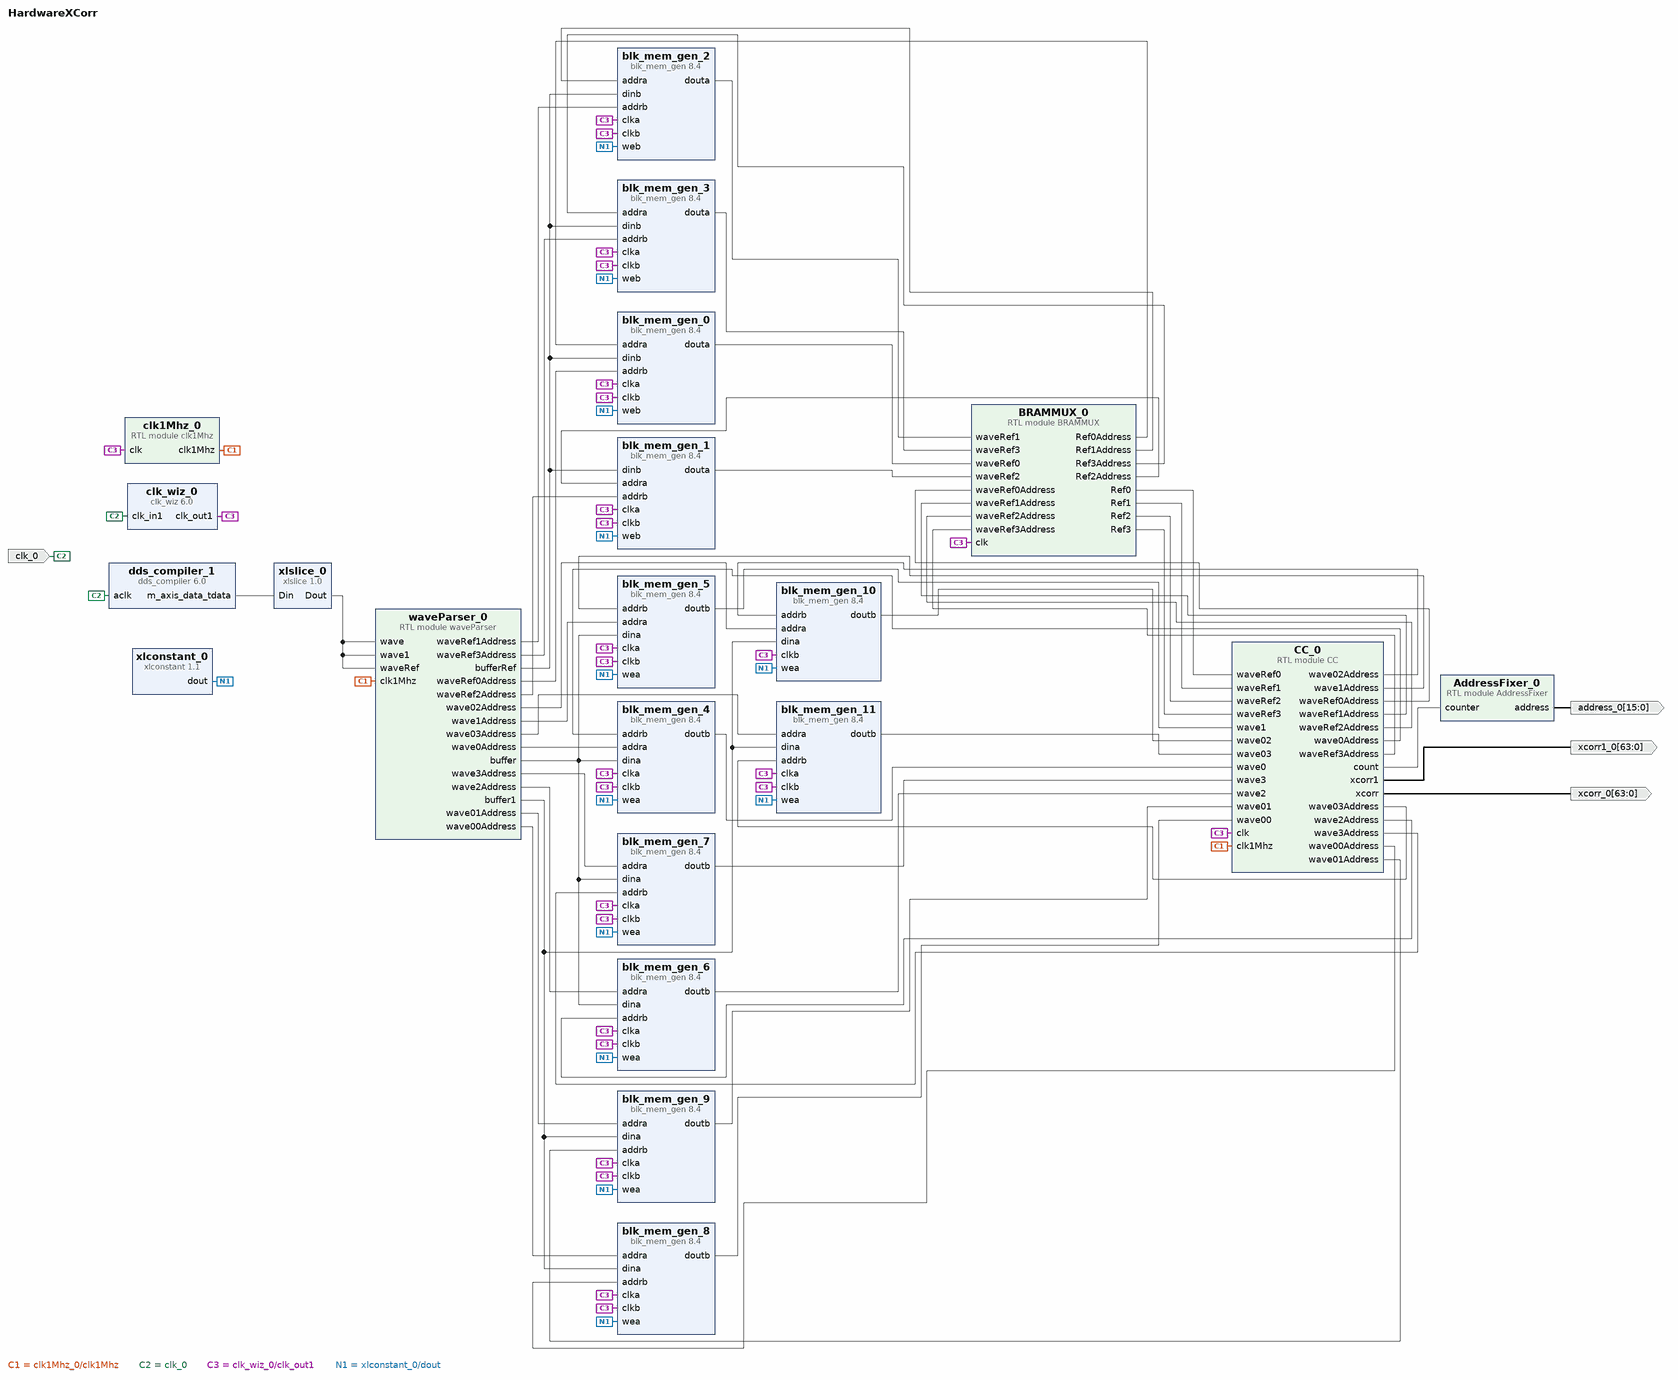
[diagram p0: block diagram of the top level]
# Vivado block design HardwareXCorr, xc7s25csga225-1, Vivado 2023.2
create_bd_design HardwareXCorr

create_bd_port -dir I -type clk clk_0
create_bd_port -dir O -from 63 -to 0 xcorr_0
create_bd_port -dir O -from 15 -to 0 address_0
create_bd_port -dir O -from 63 -to 0 xcorr1_0

create_bd_cell -type ip -vlnv xilinx.com:ip:clk_wiz:6.0 clk_wiz_0
set_property -dict [list \
  CONFIG.CLKOUT1_JITTER 114.829 \
  CONFIG.CLKOUT1_REQUESTED_OUT_FREQ 200.000 \
  CONFIG.MMCM_CLKOUT0_DIVIDE_F 5.000 \
  CONFIG.USE_LOCKED false \
  CONFIG.USE_RESET false \
] [get_bd_cells clk_wiz_0]
create_bd_cell -type ip -vlnv xilinx.com:ip:dds_compiler:6.0 dds_compiler_1
set_property -dict [list \
  CONFIG.DATA_Has_TLAST Not_Required \
  CONFIG.Has_Phase_Out true \
  CONFIG.Latency 7 \
  CONFIG.M_DATA_Has_TUSER Not_Required \
  CONFIG.Noise_Shaping None \
  CONFIG.Output_Frequency1 0 \
  CONFIG.Output_Selection Sine \
  CONFIG.Output_Width 12 \
  CONFIG.PINC1 1 \
  CONFIG.Parameter_Entry Hardware_Parameters \
  CONFIG.PartsPresent Phase_Generator_and_SIN_COS_LUT \
  CONFIG.Phase_Width 12 \
  CONFIG.S_PHASE_Has_TUSER Not_Required \
] [get_bd_cells dds_compiler_1]
create_bd_cell -type ip -vlnv xilinx.com:ip:xlslice:1.0 xlslice_0
set_property -dict {CONFIG.DIN_FROM 11 CONFIG.DIN_WIDTH 16 CONFIG.DOUT_WIDTH 12} [get_bd_cells xlslice_0]
create_bd_cell -type ip -vlnv xilinx.com:ip:blk_mem_gen:8.4 blk_mem_gen_0
set_property -dict [list \
  CONFIG.Enable_32bit_Address false \
  CONFIG.Enable_A Always_Enabled \
  CONFIG.Enable_B Always_Enabled \
  CONFIG.Memory_Type True_Dual_Port_RAM \
  CONFIG.Port_B_Clock 100 \
  CONFIG.Port_B_Enable_Rate 100 \
  CONFIG.Port_B_Write_Rate 50 \
  CONFIG.Read_Width_A 12 \
  CONFIG.Read_Width_B 12 \
  CONFIG.Register_PortA_Output_of_Memory_Primitives true \
  CONFIG.Register_PortB_Output_of_Memory_Primitives true \
  CONFIG.Use_Byte_Write_Enable false \
  CONFIG.Use_RSTA_Pin false \
  CONFIG.Write_Depth_A 2501 \
  CONFIG.Write_Width_A 12 \
  CONFIG.Write_Width_B 12 \
  CONFIG.use_bram_block Stand_Alone \
] [get_bd_cells blk_mem_gen_0]
create_bd_cell -type ip -vlnv xilinx.com:ip:blk_mem_gen:8.4 blk_mem_gen_1
set_property -dict [list \
  CONFIG.Enable_32bit_Address false \
  CONFIG.Enable_A Always_Enabled \
  CONFIG.Enable_B Always_Enabled \
  CONFIG.Memory_Type True_Dual_Port_RAM \
  CONFIG.Port_B_Clock 100 \
  CONFIG.Port_B_Enable_Rate 100 \
  CONFIG.Port_B_Write_Rate 50 \
  CONFIG.Read_Width_A 12 \
  CONFIG.Read_Width_B 12 \
  CONFIG.Register_PortA_Output_of_Memory_Primitives true \
  CONFIG.Register_PortB_Output_of_Memory_Primitives true \
  CONFIG.Use_Byte_Write_Enable false \
  CONFIG.Use_RSTA_Pin false \
  CONFIG.Write_Depth_A 2501 \
  CONFIG.Write_Width_A 12 \
  CONFIG.Write_Width_B 12 \
  CONFIG.use_bram_block Stand_Alone \
] [get_bd_cells blk_mem_gen_1]
create_bd_cell -type ip -vlnv xilinx.com:ip:blk_mem_gen:8.4 blk_mem_gen_2
set_property -dict [list \
  CONFIG.Enable_32bit_Address false \
  CONFIG.Enable_A Always_Enabled \
  CONFIG.Enable_B Always_Enabled \
  CONFIG.Memory_Type True_Dual_Port_RAM \
  CONFIG.Port_B_Clock 100 \
  CONFIG.Port_B_Enable_Rate 100 \
  CONFIG.Port_B_Write_Rate 50 \
  CONFIG.Read_Width_A 12 \
  CONFIG.Read_Width_B 12 \
  CONFIG.Register_PortA_Output_of_Memory_Primitives true \
  CONFIG.Register_PortB_Output_of_Memory_Primitives true \
  CONFIG.Use_Byte_Write_Enable false \
  CONFIG.Use_RSTA_Pin false \
  CONFIG.Write_Depth_A 2501 \
  CONFIG.Write_Width_A 12 \
  CONFIG.Write_Width_B 12 \
  CONFIG.use_bram_block Stand_Alone \
] [get_bd_cells blk_mem_gen_2]
create_bd_cell -type ip -vlnv xilinx.com:ip:blk_mem_gen:8.4 blk_mem_gen_3
set_property -dict [list \
  CONFIG.Enable_32bit_Address false \
  CONFIG.Enable_A Always_Enabled \
  CONFIG.Enable_B Always_Enabled \
  CONFIG.Memory_Type True_Dual_Port_RAM \
  CONFIG.Port_B_Clock 100 \
  CONFIG.Port_B_Enable_Rate 100 \
  CONFIG.Port_B_Write_Rate 50 \
  CONFIG.Read_Width_A 12 \
  CONFIG.Read_Width_B 12 \
  CONFIG.Register_PortA_Output_of_Memory_Primitives true \
  CONFIG.Register_PortB_Output_of_Memory_Primitives true \
  CONFIG.Use_Byte_Write_Enable false \
  CONFIG.Use_RSTA_Pin false \
  CONFIG.Write_Depth_A 2501 \
  CONFIG.Write_Width_A 12 \
  CONFIG.Write_Width_B 12 \
  CONFIG.use_bram_block Stand_Alone \
] [get_bd_cells blk_mem_gen_3]
create_bd_cell -type ip -vlnv xilinx.com:ip:xlconstant:1.1 xlconstant_0
create_bd_cell -type ip -vlnv xilinx.com:ip:blk_mem_gen:8.4 blk_mem_gen_4
set_property -dict [list \
  CONFIG.Enable_32bit_Address false \
  CONFIG.Enable_A Always_Enabled \
  CONFIG.Enable_B Always_Enabled \
  CONFIG.Memory_Type True_Dual_Port_RAM \
  CONFIG.Port_B_Clock 100 \
  CONFIG.Port_B_Enable_Rate 100 \
  CONFIG.Port_B_Write_Rate 50 \
  CONFIG.Read_Width_A 12 \
  CONFIG.Read_Width_B 12 \
  CONFIG.Register_PortA_Output_of_Memory_Primitives true \
  CONFIG.Register_PortB_Output_of_Memory_Primitives true \
  CONFIG.Use_Byte_Write_Enable false \
  CONFIG.Use_RSTA_Pin false \
  CONFIG.Write_Depth_A 2501 \
  CONFIG.Write_Width_A 12 \
  CONFIG.Write_Width_B 12 \
  CONFIG.use_bram_block Stand_Alone \
] [get_bd_cells blk_mem_gen_4]
create_bd_cell -type ip -vlnv xilinx.com:ip:blk_mem_gen:8.4 blk_mem_gen_5
set_property -dict [list \
  CONFIG.Enable_32bit_Address false \
  CONFIG.Enable_A Always_Enabled \
  CONFIG.Enable_B Always_Enabled \
  CONFIG.Memory_Type True_Dual_Port_RAM \
  CONFIG.Port_B_Clock 100 \
  CONFIG.Port_B_Enable_Rate 100 \
  CONFIG.Port_B_Write_Rate 50 \
  CONFIG.Read_Width_A 12 \
  CONFIG.Read_Width_B 12 \
  CONFIG.Register_PortA_Output_of_Memory_Primitives true \
  CONFIG.Register_PortB_Output_of_Memory_Primitives true \
  CONFIG.Use_Byte_Write_Enable false \
  CONFIG.Use_RSTA_Pin false \
  CONFIG.Write_Depth_A 2501 \
  CONFIG.Write_Width_A 12 \
  CONFIG.Write_Width_B 12 \
  CONFIG.use_bram_block Stand_Alone \
] [get_bd_cells blk_mem_gen_5]
create_bd_cell -type ip -vlnv xilinx.com:ip:blk_mem_gen:8.4 blk_mem_gen_6
set_property -dict [list \
  CONFIG.Enable_32bit_Address false \
  CONFIG.Enable_A Always_Enabled \
  CONFIG.Enable_B Always_Enabled \
  CONFIG.Memory_Type True_Dual_Port_RAM \
  CONFIG.Port_B_Clock 100 \
  CONFIG.Port_B_Enable_Rate 100 \
  CONFIG.Port_B_Write_Rate 50 \
  CONFIG.Read_Width_A 12 \
  CONFIG.Read_Width_B 12 \
  CONFIG.Register_PortA_Output_of_Memory_Primitives true \
  CONFIG.Register_PortB_Output_of_Memory_Primitives true \
  CONFIG.Use_Byte_Write_Enable false \
  CONFIG.Use_RSTA_Pin false \
  CONFIG.Write_Depth_A 2501 \
  CONFIG.Write_Width_A 12 \
  CONFIG.Write_Width_B 12 \
  CONFIG.use_bram_block Stand_Alone \
] [get_bd_cells blk_mem_gen_6]
create_bd_cell -type ip -vlnv xilinx.com:ip:blk_mem_gen:8.4 blk_mem_gen_7
set_property -dict [list \
  CONFIG.Enable_32bit_Address false \
  CONFIG.Enable_A Always_Enabled \
  CONFIG.Enable_B Always_Enabled \
  CONFIG.Memory_Type True_Dual_Port_RAM \
  CONFIG.Port_B_Clock 100 \
  CONFIG.Port_B_Enable_Rate 100 \
  CONFIG.Port_B_Write_Rate 50 \
  CONFIG.Read_Width_A 12 \
  CONFIG.Read_Width_B 12 \
  CONFIG.Register_PortA_Output_of_Memory_Primitives true \
  CONFIG.Register_PortB_Output_of_Memory_Primitives true \
  CONFIG.Use_Byte_Write_Enable false \
  CONFIG.Use_RSTA_Pin false \
  CONFIG.Write_Depth_A 2501 \
  CONFIG.Write_Width_A 12 \
  CONFIG.Write_Width_B 12 \
  CONFIG.use_bram_block Stand_Alone \
] [get_bd_cells blk_mem_gen_7]
create_bd_cell -type ip -vlnv xilinx.com:ip:blk_mem_gen:8.4 blk_mem_gen_8
set_property -dict [list \
  CONFIG.Assume_Synchronous_Clk true \
  CONFIG.Enable_32bit_Address false \
  CONFIG.Enable_A Always_Enabled \
  CONFIG.Enable_B Always_Enabled \
  CONFIG.Memory_Type True_Dual_Port_RAM \
  CONFIG.Port_B_Clock 100 \
  CONFIG.Port_B_Enable_Rate 100 \
  CONFIG.Port_B_Write_Rate 50 \
  CONFIG.Read_Width_A 12 \
  CONFIG.Read_Width_B 12 \
  CONFIG.Register_PortA_Output_of_Memory_Primitives true \
  CONFIG.Register_PortB_Output_of_Memory_Primitives true \
  CONFIG.Use_Byte_Write_Enable false \
  CONFIG.Use_RSTA_Pin false \
  CONFIG.Write_Depth_A 2501 \
  CONFIG.Write_Width_A 12 \
  CONFIG.Write_Width_B 12 \
  CONFIG.use_bram_block Stand_Alone \
] [get_bd_cells blk_mem_gen_8]
create_bd_cell -type ip -vlnv xilinx.com:ip:blk_mem_gen:8.4 blk_mem_gen_9
set_property -dict [list \
  CONFIG.Assume_Synchronous_Clk true \
  CONFIG.Enable_32bit_Address false \
  CONFIG.Enable_A Always_Enabled \
  CONFIG.Enable_B Always_Enabled \
  CONFIG.Memory_Type True_Dual_Port_RAM \
  CONFIG.Port_B_Clock 100 \
  CONFIG.Port_B_Enable_Rate 100 \
  CONFIG.Port_B_Write_Rate 50 \
  CONFIG.Read_Width_A 12 \
  CONFIG.Read_Width_B 12 \
  CONFIG.Register_PortA_Output_of_Memory_Primitives true \
  CONFIG.Register_PortB_Output_of_Memory_Primitives true \
  CONFIG.Use_Byte_Write_Enable false \
  CONFIG.Use_RSTA_Pin false \
  CONFIG.Write_Depth_A 2501 \
  CONFIG.Write_Width_A 12 \
  CONFIG.Write_Width_B 12 \
  CONFIG.use_bram_block Stand_Alone \
] [get_bd_cells blk_mem_gen_9]
create_bd_cell -type ip -vlnv xilinx.com:ip:blk_mem_gen:8.4 blk_mem_gen_10
set_property -dict [list \
  CONFIG.Assume_Synchronous_Clk true \
  CONFIG.Enable_32bit_Address false \
  CONFIG.Enable_A Always_Enabled \
  CONFIG.Enable_B Always_Enabled \
  CONFIG.Memory_Type True_Dual_Port_RAM \
  CONFIG.Port_B_Clock 100 \
  CONFIG.Port_B_Enable_Rate 100 \
  CONFIG.Port_B_Write_Rate 50 \
  CONFIG.Read_Width_A 12 \
  CONFIG.Read_Width_B 12 \
  CONFIG.Register_PortA_Output_of_Memory_Primitives true \
  CONFIG.Register_PortB_Output_of_Memory_Primitives true \
  CONFIG.Use_Byte_Write_Enable false \
  CONFIG.Use_RSTA_Pin false \
  CONFIG.Write_Depth_A 2501 \
  CONFIG.Write_Width_A 12 \
  CONFIG.Write_Width_B 12 \
  CONFIG.use_bram_block Stand_Alone \
] [get_bd_cells blk_mem_gen_10]
create_bd_cell -type ip -vlnv xilinx.com:ip:blk_mem_gen:8.4 blk_mem_gen_11
set_property -dict [list \
  CONFIG.Assume_Synchronous_Clk true \
  CONFIG.Enable_32bit_Address false \
  CONFIG.Enable_A Always_Enabled \
  CONFIG.Enable_B Always_Enabled \
  CONFIG.Memory_Type True_Dual_Port_RAM \
  CONFIG.Port_B_Clock 100 \
  CONFIG.Port_B_Enable_Rate 100 \
  CONFIG.Port_B_Write_Rate 50 \
  CONFIG.Read_Width_A 12 \
  CONFIG.Read_Width_B 12 \
  CONFIG.Register_PortA_Output_of_Memory_Primitives true \
  CONFIG.Register_PortB_Output_of_Memory_Primitives true \
  CONFIG.Use_Byte_Write_Enable false \
  CONFIG.Use_RSTA_Pin false \
  CONFIG.Write_Depth_A 2501 \
  CONFIG.Write_Width_A 12 \
  CONFIG.Write_Width_B 12 \
  CONFIG.use_bram_block Stand_Alone \
] [get_bd_cells blk_mem_gen_11]
create_bd_cell -type module -reference BRAMMUX BRAMMUX_0
create_bd_cell -type module -reference AddressFixer AddressFixer_0
create_bd_cell -type module -reference waveParser waveParser_0
create_bd_cell -type module -reference CC CC_0
create_bd_cell -type module -reference clk1Mhz clk1Mhz_0

# ---- connections ----

connect_bd_net [get_bd_pins AddressFixer_0/address] [get_bd_ports address_0]
connect_bd_net [get_bd_pins BRAMMUX_0/Ref0] [get_bd_pins CC_0/waveRef0]
connect_bd_net [get_bd_pins BRAMMUX_0/Ref0Address] [get_bd_pins blk_mem_gen_0/addra]
connect_bd_net [get_bd_pins BRAMMUX_0/Ref1] [get_bd_pins CC_0/waveRef1]
connect_bd_net [get_bd_pins BRAMMUX_0/Ref1Address] [get_bd_pins blk_mem_gen_2/addra]
connect_bd_net [get_bd_pins BRAMMUX_0/Ref2] [get_bd_pins CC_0/waveRef2]
connect_bd_net [get_bd_pins BRAMMUX_0/Ref2Address] [get_bd_pins blk_mem_gen_1/addra]
connect_bd_net [get_bd_pins BRAMMUX_0/Ref3] [get_bd_pins CC_0/waveRef3]
connect_bd_net [get_bd_pins BRAMMUX_0/Ref3Address] [get_bd_pins blk_mem_gen_3/addra]
connect_bd_net [get_bd_pins CC_0/count] [get_bd_pins AddressFixer_0/counter]
connect_bd_net [get_bd_pins CC_0/wave00Address] [get_bd_pins blk_mem_gen_8/addrb]
connect_bd_net [get_bd_pins CC_0/wave01Address] [get_bd_pins blk_mem_gen_9/addrb]
connect_bd_net [get_bd_pins CC_0/wave02Address] [get_bd_pins blk_mem_gen_10/addrb]
connect_bd_net [get_bd_pins CC_0/wave03Address] [get_bd_pins blk_mem_gen_11/addrb]
connect_bd_net [get_bd_pins CC_0/wave0Address] [get_bd_pins blk_mem_gen_4/addrb]
connect_bd_net [get_bd_pins CC_0/wave1Address] [get_bd_pins blk_mem_gen_5/addrb]
connect_bd_net [get_bd_pins CC_0/wave2Address] [get_bd_pins blk_mem_gen_6/addrb]
connect_bd_net [get_bd_pins CC_0/wave3Address] [get_bd_pins blk_mem_gen_7/addrb]
connect_bd_net [get_bd_pins CC_0/waveRef0Address] [get_bd_pins BRAMMUX_0/waveRef0Address]
connect_bd_net [get_bd_pins CC_0/waveRef1Address] [get_bd_pins BRAMMUX_0/waveRef1Address]
connect_bd_net [get_bd_pins CC_0/waveRef2Address] [get_bd_pins BRAMMUX_0/waveRef2Address]
connect_bd_net [get_bd_pins CC_0/waveRef3Address] [get_bd_pins BRAMMUX_0/waveRef3Address]
connect_bd_net [get_bd_pins CC_0/xcorr] [get_bd_ports xcorr_0]
connect_bd_net [get_bd_pins CC_0/xcorr1] [get_bd_ports xcorr1_0]
connect_bd_net [get_bd_pins blk_mem_gen_0/douta] [get_bd_pins BRAMMUX_0/waveRef0]
connect_bd_net [get_bd_pins blk_mem_gen_10/doutb] [get_bd_pins CC_0/wave02]
connect_bd_net [get_bd_pins blk_mem_gen_11/doutb] [get_bd_pins CC_0/wave03]
connect_bd_net [get_bd_pins blk_mem_gen_1/douta] [get_bd_pins BRAMMUX_0/waveRef2]
connect_bd_net [get_bd_pins blk_mem_gen_2/douta] [get_bd_pins BRAMMUX_0/waveRef1]
connect_bd_net [get_bd_pins blk_mem_gen_3/douta] [get_bd_pins BRAMMUX_0/waveRef3]
connect_bd_net [get_bd_pins blk_mem_gen_4/doutb] [get_bd_pins CC_0/wave0]
connect_bd_net [get_bd_pins blk_mem_gen_5/doutb] [get_bd_pins CC_0/wave1]
connect_bd_net [get_bd_pins blk_mem_gen_6/doutb] [get_bd_pins CC_0/wave2]
connect_bd_net [get_bd_pins blk_mem_gen_7/doutb] [get_bd_pins CC_0/wave3]
connect_bd_net [get_bd_pins blk_mem_gen_8/doutb] [get_bd_pins CC_0/wave00]
connect_bd_net [get_bd_pins blk_mem_gen_9/doutb] [get_bd_pins CC_0/wave01]
connect_bd_net -net clk100khz_0_clk100k [get_bd_pins clk1Mhz_0/clk1Mhz] [get_bd_pins CC_0/clk1Mhz] [get_bd_pins waveParser_0/clk1Mhz]
connect_bd_net -net clk_0_1 [get_bd_ports clk_0] [get_bd_pins clk_wiz_0/clk_in1] [get_bd_pins dds_compiler_1/aclk]
connect_bd_net [get_bd_pins clk_wiz_0/clk_out1] \
  [get_bd_pins blk_mem_gen_0/clka] [get_bd_pins blk_mem_gen_0/clkb] [get_bd_pins blk_mem_gen_1/clka] \
  [get_bd_pins blk_mem_gen_1/clkb] [get_bd_pins blk_mem_gen_2/clka] [get_bd_pins blk_mem_gen_2/clkb] \
  [get_bd_pins blk_mem_gen_3/clka] [get_bd_pins blk_mem_gen_3/clkb] [get_bd_pins blk_mem_gen_4/clka] \
  [get_bd_pins blk_mem_gen_4/clkb] [get_bd_pins blk_mem_gen_5/clka] [get_bd_pins blk_mem_gen_5/clkb] \
  [get_bd_pins blk_mem_gen_6/clka] [get_bd_pins blk_mem_gen_6/clkb] [get_bd_pins blk_mem_gen_7/clka] \
  [get_bd_pins blk_mem_gen_7/clkb] [get_bd_pins blk_mem_gen_8/clka] [get_bd_pins blk_mem_gen_8/clkb] \
  [get_bd_pins blk_mem_gen_9/clka] [get_bd_pins blk_mem_gen_9/clkb] [get_bd_pins blk_mem_gen_10/clkb] \
  [get_bd_pins blk_mem_gen_11/clka] [get_bd_pins blk_mem_gen_11/clkb] [get_bd_pins BRAMMUX_0/clk] [get_bd_pins CC_0/clk] \
  [get_bd_pins clk1Mhz_0/clk]
connect_bd_net [get_bd_pins dds_compiler_1/m_axis_data_tdata] [get_bd_pins xlslice_0/Din]
connect_bd_net [get_bd_pins waveParser_0/buffer] \
  [get_bd_pins blk_mem_gen_4/dina] [get_bd_pins blk_mem_gen_5/dina] [get_bd_pins blk_mem_gen_6/dina] \
  [get_bd_pins blk_mem_gen_7/dina]
connect_bd_net [get_bd_pins waveParser_0/buffer1] \
  [get_bd_pins blk_mem_gen_8/dina] [get_bd_pins blk_mem_gen_9/dina] [get_bd_pins blk_mem_gen_10/dina] \
  [get_bd_pins blk_mem_gen_11/dina]
connect_bd_net [get_bd_pins waveParser_0/bufferRef] \
  [get_bd_pins blk_mem_gen_0/dinb] [get_bd_pins blk_mem_gen_1/dinb] [get_bd_pins blk_mem_gen_2/dinb] \
  [get_bd_pins blk_mem_gen_3/dinb]
connect_bd_net [get_bd_pins waveParser_0/wave00Address] [get_bd_pins blk_mem_gen_8/addra]
connect_bd_net [get_bd_pins waveParser_0/wave01Address] [get_bd_pins blk_mem_gen_9/addra]
connect_bd_net [get_bd_pins waveParser_0/wave02Address] [get_bd_pins blk_mem_gen_10/addra]
connect_bd_net [get_bd_pins waveParser_0/wave03Address] [get_bd_pins blk_mem_gen_11/addra]
connect_bd_net [get_bd_pins waveParser_0/wave0Address] [get_bd_pins blk_mem_gen_4/addra]
connect_bd_net [get_bd_pins waveParser_0/wave1Address] [get_bd_pins blk_mem_gen_5/addra]
connect_bd_net [get_bd_pins waveParser_0/wave2Address] [get_bd_pins blk_mem_gen_6/addra]
connect_bd_net [get_bd_pins waveParser_0/wave3Address] [get_bd_pins blk_mem_gen_7/addra]
connect_bd_net [get_bd_pins waveParser_0/waveRef0Address] [get_bd_pins blk_mem_gen_0/addrb]
connect_bd_net [get_bd_pins waveParser_0/waveRef1Address] [get_bd_pins blk_mem_gen_2/addrb]
connect_bd_net [get_bd_pins waveParser_0/waveRef2Address] [get_bd_pins blk_mem_gen_1/addrb]
connect_bd_net [get_bd_pins waveParser_0/waveRef3Address] [get_bd_pins blk_mem_gen_3/addrb]
connect_bd_net [get_bd_pins xlconstant_0/dout] \
  [get_bd_pins blk_mem_gen_0/web] [get_bd_pins blk_mem_gen_1/web] [get_bd_pins blk_mem_gen_2/web] \
  [get_bd_pins blk_mem_gen_3/web] [get_bd_pins blk_mem_gen_4/wea] [get_bd_pins blk_mem_gen_5/wea] \
  [get_bd_pins blk_mem_gen_6/wea] [get_bd_pins blk_mem_gen_7/wea] [get_bd_pins blk_mem_gen_8/wea] \
  [get_bd_pins blk_mem_gen_9/wea] [get_bd_pins blk_mem_gen_10/wea] [get_bd_pins blk_mem_gen_11/wea]
connect_bd_net [get_bd_pins xlslice_0/Dout] [get_bd_pins waveParser_0/waveRef] [get_bd_pins waveParser_0/wave] [get_bd_pins waveParser_0/wave1]

validate_bd_design
save_bd_design
